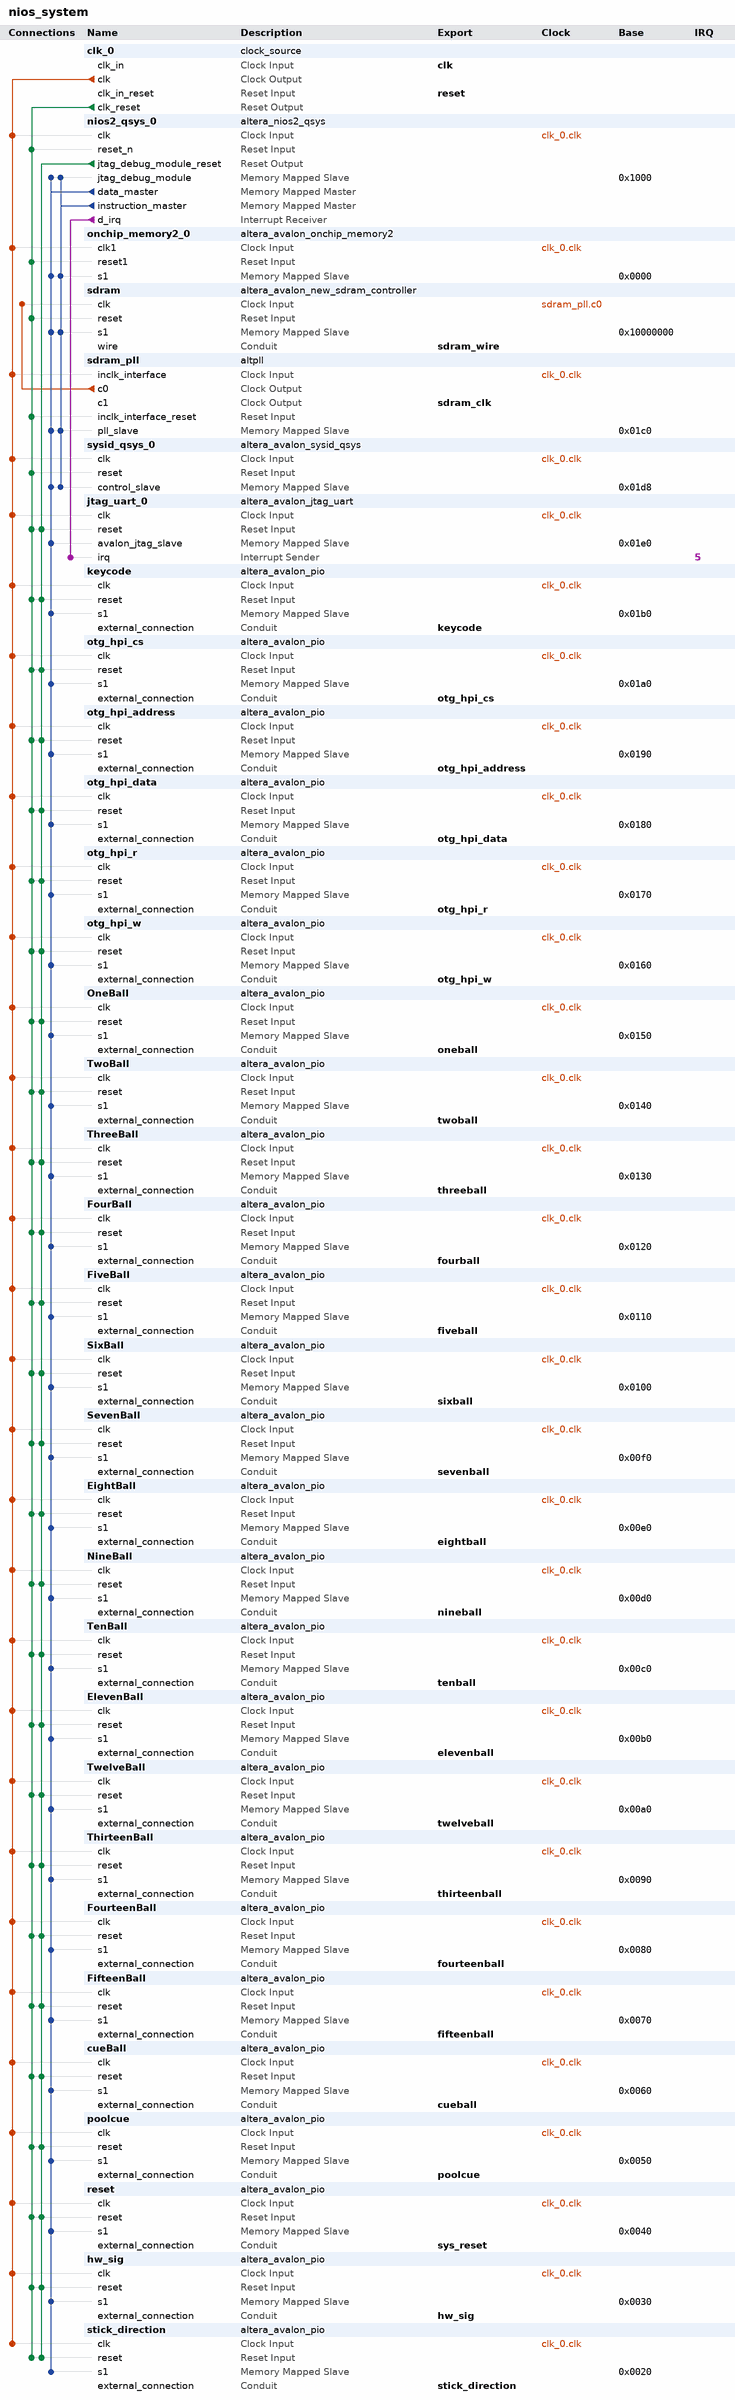
[diagram p0: system contents]
# Platform Designer (Qsys) system nios_system, Cyclone IV E EP4CE115F29C7
# Parameters at their usual value, and those the tool derives, are not listed.
package require -exact qsys 14.0
create_system nios_system
set_project_property DEVICE_FAMILY {Cyclone IV E}
set_project_property DEVICE EP4CE115F29C7

add_instance clk_0 clock_source 14.0
set_instance_parameter_value clk_0 clockFrequency 50000000

add_instance nios2_qsys_0 altera_nios2_qsys 14.0
set_instance_parameter_value nios2_qsys_0 resetrequest_enabled true
set_instance_parameter_value nios2_qsys_0 resetSlave sdram.s1
set_instance_parameter_value nios2_qsys_0 mmu_TLBMissExcSlave None
set_instance_parameter_value nios2_qsys_0 exceptionSlave sdram.s1
set_instance_parameter_value nios2_qsys_0 breakSlave nios2_qsys_0.jtag_debug_module
set_instance_parameter_value nios2_qsys_0 impl Tiny
set_instance_parameter_value nios2_qsys_0 icache_size 4096

add_instance onchip_memory2_0 altera_avalon_onchip_memory2 14.0
set_instance_parameter_value onchip_memory2_0 dataWidth 32
set_instance_parameter_value onchip_memory2_0 dualPort false
set_instance_parameter_value onchip_memory2_0 initMemContent true
set_instance_parameter_value onchip_memory2_0 initializationFileName onchip_mem.hex
set_instance_parameter_value onchip_memory2_0 memorySize 16

add_instance sdram altera_avalon_new_sdram_controller 14.0
set_instance_parameter_value sdram TAC 5.5
set_instance_parameter_value sdram TRCD 20.0
set_instance_parameter_value sdram TRP 20.0
set_instance_parameter_value sdram casLatency 3
set_instance_parameter_value sdram columnWidth 10
set_instance_parameter_value sdram dataWidth 32
set_instance_parameter_value sdram generateSimulationModel false
set_instance_parameter_value sdram model single_Micron_MT48LC4M32B2_7_chip
set_instance_parameter_value sdram numberOfBanks 4
set_instance_parameter_value sdram numberOfChipSelects 1
set_instance_parameter_value sdram powerUpDelay 200.0
set_instance_parameter_value sdram refreshPeriod 7.8125
set_instance_parameter_value sdram rowWidth 13

add_instance sdram_pll altpll 14.0
set_instance_parameter_value sdram_pll INCLK0_INPUT_FREQUENCY 20000
set_instance_parameter_value sdram_pll CLK0_MULTIPLY_BY 1
set_instance_parameter_value sdram_pll CLK1_MULTIPLY_BY 1
set_instance_parameter_value sdram_pll CLK0_DIVIDE_BY 1
set_instance_parameter_value sdram_pll CLK1_DIVIDE_BY 1
set_instance_parameter_value sdram_pll CLK1_PHASE_SHIFT -3000
set_instance_parameter_value sdram_pll CLK1_DUTY_CYCLE 50
set_instance_parameter_value sdram_pll PORT_clk1 PORT_USED
set_instance_parameter_value sdram_pll PORT_clk2 PORT_UNUSED
set_instance_parameter_value sdram_pll PORT_clk3 PORT_UNUSED
set_instance_parameter_value sdram_pll PORT_ARESET PORT_UNUSED
set_instance_parameter_value sdram_pll PORT_LOCKED PORT_UNUSED

add_instance sysid_qsys_0 altera_avalon_sysid_qsys 14.0
set_instance_parameter_value sysid_qsys_0 id 0

add_instance jtag_uart_0 altera_avalon_jtag_uart 14.0
set_instance_parameter_value jtag_uart_0 simInteractiveOptions NO_INTERACTIVE_WINDOWS

add_instance keycode altera_avalon_pio 14.0
set_instance_parameter_value keycode direction Output
set_instance_parameter_value keycode width 16

add_instance otg_hpi_cs altera_avalon_pio 14.0
set_instance_parameter_value otg_hpi_cs direction Output
set_instance_parameter_value otg_hpi_cs width 1

add_instance otg_hpi_address altera_avalon_pio 14.0
set_instance_parameter_value otg_hpi_address direction Output
set_instance_parameter_value otg_hpi_address width 2

add_instance otg_hpi_data altera_avalon_pio 14.0
set_instance_parameter_value otg_hpi_data direction InOut
set_instance_parameter_value otg_hpi_data width 16

add_instance otg_hpi_r altera_avalon_pio 14.0
set_instance_parameter_value otg_hpi_r direction Output
set_instance_parameter_value otg_hpi_r width 1

add_instance otg_hpi_w altera_avalon_pio 14.0
set_instance_parameter_value otg_hpi_w direction Output
set_instance_parameter_value otg_hpi_w width 1

add_instance OneBall altera_avalon_pio 14.0
set_instance_parameter_value OneBall direction Output
set_instance_parameter_value OneBall width 20

add_instance TwoBall altera_avalon_pio 14.0
set_instance_parameter_value TwoBall direction Output
set_instance_parameter_value TwoBall width 20

add_instance ThreeBall altera_avalon_pio 14.0
set_instance_parameter_value ThreeBall direction Output
set_instance_parameter_value ThreeBall width 20

add_instance FourBall altera_avalon_pio 14.0
set_instance_parameter_value FourBall direction Output
set_instance_parameter_value FourBall width 20

add_instance FiveBall altera_avalon_pio 14.0
set_instance_parameter_value FiveBall direction Output
set_instance_parameter_value FiveBall width 20

add_instance SixBall altera_avalon_pio 14.0
set_instance_parameter_value SixBall direction Output
set_instance_parameter_value SixBall width 20

add_instance SevenBall altera_avalon_pio 14.0
set_instance_parameter_value SevenBall direction Output
set_instance_parameter_value SevenBall width 20

add_instance EightBall altera_avalon_pio 14.0
set_instance_parameter_value EightBall direction Output
set_instance_parameter_value EightBall width 20

add_instance NineBall altera_avalon_pio 14.0
set_instance_parameter_value NineBall direction Output
set_instance_parameter_value NineBall width 20

add_instance TenBall altera_avalon_pio 14.0
set_instance_parameter_value TenBall direction Output
set_instance_parameter_value TenBall width 20

add_instance ElevenBall altera_avalon_pio 14.0
set_instance_parameter_value ElevenBall direction Output
set_instance_parameter_value ElevenBall width 20

add_instance TwelveBall altera_avalon_pio 14.0
set_instance_parameter_value TwelveBall direction Output
set_instance_parameter_value TwelveBall width 20

add_instance ThirteenBall altera_avalon_pio 14.0
set_instance_parameter_value ThirteenBall direction Output
set_instance_parameter_value ThirteenBall width 20

add_instance FourteenBall altera_avalon_pio 14.0
set_instance_parameter_value FourteenBall direction Output
set_instance_parameter_value FourteenBall width 20

add_instance FifteenBall altera_avalon_pio 14.0
set_instance_parameter_value FifteenBall direction Output
set_instance_parameter_value FifteenBall width 20

add_instance cueBall altera_avalon_pio 14.0
set_instance_parameter_value cueBall direction Output
set_instance_parameter_value cueBall width 20

add_instance poolcue altera_avalon_pio 14.0
set_instance_parameter_value poolcue direction Output
set_instance_parameter_value poolcue width 20

add_instance reset altera_avalon_pio 14.0
set_instance_parameter_value reset direction Input
set_instance_parameter_value reset width 1

add_instance hw_sig altera_avalon_pio 14.0
set_instance_parameter_value hw_sig direction Input
set_instance_parameter_value hw_sig width 1

add_instance stick_direction altera_avalon_pio 14.0
set_instance_parameter_value stick_direction direction Output
set_instance_parameter_value stick_direction width 3

# connections
add_connection clk_0.clk cueBall.clk clock
add_connection clk_0.clk EightBall.clk clock
add_connection clk_0.clk ElevenBall.clk clock
add_connection clk_0.clk FifteenBall.clk clock
add_connection clk_0.clk FiveBall.clk clock
add_connection clk_0.clk FourBall.clk clock
add_connection clk_0.clk FourteenBall.clk clock
add_connection clk_0.clk hw_sig.clk clock
add_connection clk_0.clk jtag_uart_0.clk clock
add_connection clk_0.clk keycode.clk clock
add_connection clk_0.clk NineBall.clk clock
add_connection clk_0.clk nios2_qsys_0.clk clock
add_connection clk_0.clk onchip_memory2_0.clk1 clock
add_connection clk_0.clk OneBall.clk clock
add_connection clk_0.clk otg_hpi_address.clk clock
add_connection clk_0.clk otg_hpi_cs.clk clock
add_connection clk_0.clk otg_hpi_data.clk clock
add_connection clk_0.clk otg_hpi_r.clk clock
add_connection clk_0.clk otg_hpi_w.clk clock
add_connection clk_0.clk poolcue.clk clock
add_connection clk_0.clk reset.clk clock
add_connection clk_0.clk sdram_pll.inclk_interface clock
add_connection clk_0.clk SevenBall.clk clock
add_connection clk_0.clk SixBall.clk clock
add_connection clk_0.clk stick_direction.clk clock
add_connection clk_0.clk sysid_qsys_0.clk clock
add_connection clk_0.clk TenBall.clk clock
add_connection clk_0.clk ThirteenBall.clk clock
add_connection clk_0.clk ThreeBall.clk clock
add_connection clk_0.clk TwelveBall.clk clock
add_connection clk_0.clk TwoBall.clk clock
add_connection sdram_pll.c0 sdram.clk clock
add_connection clk_0.clk_reset cueBall.reset reset
add_connection clk_0.clk_reset EightBall.reset reset
add_connection clk_0.clk_reset ElevenBall.reset reset
add_connection clk_0.clk_reset FifteenBall.reset reset
add_connection clk_0.clk_reset FiveBall.reset reset
add_connection clk_0.clk_reset FourBall.reset reset
add_connection clk_0.clk_reset FourteenBall.reset reset
add_connection clk_0.clk_reset hw_sig.reset reset
add_connection clk_0.clk_reset jtag_uart_0.reset reset
add_connection clk_0.clk_reset keycode.reset reset
add_connection clk_0.clk_reset NineBall.reset reset
add_connection clk_0.clk_reset nios2_qsys_0.reset_n reset
add_connection clk_0.clk_reset onchip_memory2_0.reset1 reset
add_connection clk_0.clk_reset OneBall.reset reset
add_connection clk_0.clk_reset otg_hpi_address.reset reset
add_connection clk_0.clk_reset otg_hpi_cs.reset reset
add_connection clk_0.clk_reset otg_hpi_data.reset reset
add_connection clk_0.clk_reset otg_hpi_r.reset reset
add_connection clk_0.clk_reset otg_hpi_w.reset reset
add_connection clk_0.clk_reset poolcue.reset reset
add_connection clk_0.clk_reset reset.reset reset
add_connection clk_0.clk_reset sdram.reset reset
add_connection clk_0.clk_reset sdram_pll.inclk_interface_reset reset
add_connection clk_0.clk_reset SevenBall.reset reset
add_connection clk_0.clk_reset SixBall.reset reset
add_connection clk_0.clk_reset stick_direction.reset reset
add_connection clk_0.clk_reset sysid_qsys_0.reset reset
add_connection clk_0.clk_reset TenBall.reset reset
add_connection clk_0.clk_reset ThirteenBall.reset reset
add_connection clk_0.clk_reset ThreeBall.reset reset
add_connection clk_0.clk_reset TwelveBall.reset reset
add_connection clk_0.clk_reset TwoBall.reset reset
add_connection nios2_qsys_0.jtag_debug_module_reset cueBall.reset reset
add_connection nios2_qsys_0.jtag_debug_module_reset EightBall.reset reset
add_connection nios2_qsys_0.jtag_debug_module_reset ElevenBall.reset reset
add_connection nios2_qsys_0.jtag_debug_module_reset FifteenBall.reset reset
add_connection nios2_qsys_0.jtag_debug_module_reset FiveBall.reset reset
add_connection nios2_qsys_0.jtag_debug_module_reset FourBall.reset reset
add_connection nios2_qsys_0.jtag_debug_module_reset FourteenBall.reset reset
add_connection nios2_qsys_0.jtag_debug_module_reset hw_sig.reset reset
add_connection nios2_qsys_0.jtag_debug_module_reset jtag_uart_0.reset reset
add_connection nios2_qsys_0.jtag_debug_module_reset keycode.reset reset
add_connection nios2_qsys_0.jtag_debug_module_reset NineBall.reset reset
add_connection nios2_qsys_0.jtag_debug_module_reset OneBall.reset reset
add_connection nios2_qsys_0.jtag_debug_module_reset otg_hpi_address.reset reset
add_connection nios2_qsys_0.jtag_debug_module_reset otg_hpi_cs.reset reset
add_connection nios2_qsys_0.jtag_debug_module_reset otg_hpi_data.reset reset
add_connection nios2_qsys_0.jtag_debug_module_reset otg_hpi_r.reset reset
add_connection nios2_qsys_0.jtag_debug_module_reset otg_hpi_w.reset reset
add_connection nios2_qsys_0.jtag_debug_module_reset poolcue.reset reset
add_connection nios2_qsys_0.jtag_debug_module_reset reset.reset reset
add_connection nios2_qsys_0.jtag_debug_module_reset SevenBall.reset reset
add_connection nios2_qsys_0.jtag_debug_module_reset SixBall.reset reset
add_connection nios2_qsys_0.jtag_debug_module_reset stick_direction.reset reset
add_connection nios2_qsys_0.jtag_debug_module_reset TenBall.reset reset
add_connection nios2_qsys_0.jtag_debug_module_reset ThirteenBall.reset reset
add_connection nios2_qsys_0.jtag_debug_module_reset ThreeBall.reset reset
add_connection nios2_qsys_0.jtag_debug_module_reset TwelveBall.reset reset
add_connection nios2_qsys_0.jtag_debug_module_reset TwoBall.reset reset
add_connection nios2_qsys_0.data_master cueBall.s1 avalon
set_connection_parameter_value nios2_qsys_0.data_master/cueBall.s1 baseAddress 0x0060
add_connection nios2_qsys_0.data_master EightBall.s1 avalon
set_connection_parameter_value nios2_qsys_0.data_master/EightBall.s1 baseAddress 0x00e0
add_connection nios2_qsys_0.data_master ElevenBall.s1 avalon
set_connection_parameter_value nios2_qsys_0.data_master/ElevenBall.s1 baseAddress 0x00b0
add_connection nios2_qsys_0.data_master FifteenBall.s1 avalon
set_connection_parameter_value nios2_qsys_0.data_master/FifteenBall.s1 baseAddress 0x0070
add_connection nios2_qsys_0.data_master FiveBall.s1 avalon
set_connection_parameter_value nios2_qsys_0.data_master/FiveBall.s1 baseAddress 0x0110
add_connection nios2_qsys_0.data_master FourBall.s1 avalon
set_connection_parameter_value nios2_qsys_0.data_master/FourBall.s1 baseAddress 0x0120
add_connection nios2_qsys_0.data_master FourteenBall.s1 avalon
set_connection_parameter_value nios2_qsys_0.data_master/FourteenBall.s1 baseAddress 0x0080
add_connection nios2_qsys_0.data_master hw_sig.s1 avalon
set_connection_parameter_value nios2_qsys_0.data_master/hw_sig.s1 baseAddress 0x0030
add_connection nios2_qsys_0.data_master jtag_uart_0.avalon_jtag_slave avalon
set_connection_parameter_value nios2_qsys_0.data_master/jtag_uart_0.avalon_jtag_slave baseAddress 0x01e0
add_connection nios2_qsys_0.data_master keycode.s1 avalon
set_connection_parameter_value nios2_qsys_0.data_master/keycode.s1 baseAddress 0x01b0
add_connection nios2_qsys_0.data_master NineBall.s1 avalon
set_connection_parameter_value nios2_qsys_0.data_master/NineBall.s1 baseAddress 0x00d0
add_connection nios2_qsys_0.data_master nios2_qsys_0.jtag_debug_module avalon
set_connection_parameter_value nios2_qsys_0.data_master/nios2_qsys_0.jtag_debug_module baseAddress 0x1000
add_connection nios2_qsys_0.data_master onchip_memory2_0.s1 avalon
set_connection_parameter_value nios2_qsys_0.data_master/onchip_memory2_0.s1 baseAddress 0x0000
add_connection nios2_qsys_0.data_master OneBall.s1 avalon
set_connection_parameter_value nios2_qsys_0.data_master/OneBall.s1 baseAddress 0x0150
add_connection nios2_qsys_0.data_master otg_hpi_address.s1 avalon
set_connection_parameter_value nios2_qsys_0.data_master/otg_hpi_address.s1 baseAddress 0x0190
add_connection nios2_qsys_0.data_master otg_hpi_cs.s1 avalon
set_connection_parameter_value nios2_qsys_0.data_master/otg_hpi_cs.s1 baseAddress 0x01a0
add_connection nios2_qsys_0.data_master otg_hpi_data.s1 avalon
set_connection_parameter_value nios2_qsys_0.data_master/otg_hpi_data.s1 baseAddress 0x0180
add_connection nios2_qsys_0.data_master otg_hpi_r.s1 avalon
set_connection_parameter_value nios2_qsys_0.data_master/otg_hpi_r.s1 baseAddress 0x0170
add_connection nios2_qsys_0.data_master otg_hpi_w.s1 avalon
set_connection_parameter_value nios2_qsys_0.data_master/otg_hpi_w.s1 baseAddress 0x0160
add_connection nios2_qsys_0.data_master poolcue.s1 avalon
set_connection_parameter_value nios2_qsys_0.data_master/poolcue.s1 baseAddress 0x0050
add_connection nios2_qsys_0.data_master reset.s1 avalon
set_connection_parameter_value nios2_qsys_0.data_master/reset.s1 baseAddress 0x0040
add_connection nios2_qsys_0.data_master sdram.s1 avalon
set_connection_parameter_value nios2_qsys_0.data_master/sdram.s1 baseAddress 0x10000000
add_connection nios2_qsys_0.data_master sdram_pll.pll_slave avalon
set_connection_parameter_value nios2_qsys_0.data_master/sdram_pll.pll_slave baseAddress 0x01c0
add_connection nios2_qsys_0.data_master SevenBall.s1 avalon
set_connection_parameter_value nios2_qsys_0.data_master/SevenBall.s1 baseAddress 0x00f0
add_connection nios2_qsys_0.data_master SixBall.s1 avalon
set_connection_parameter_value nios2_qsys_0.data_master/SixBall.s1 baseAddress 0x0100
add_connection nios2_qsys_0.data_master stick_direction.s1 avalon
set_connection_parameter_value nios2_qsys_0.data_master/stick_direction.s1 baseAddress 0x0020
add_connection nios2_qsys_0.data_master sysid_qsys_0.control_slave avalon
set_connection_parameter_value nios2_qsys_0.data_master/sysid_qsys_0.control_slave baseAddress 0x01d8
add_connection nios2_qsys_0.data_master TenBall.s1 avalon
set_connection_parameter_value nios2_qsys_0.data_master/TenBall.s1 baseAddress 0x00c0
add_connection nios2_qsys_0.data_master ThirteenBall.s1 avalon
set_connection_parameter_value nios2_qsys_0.data_master/ThirteenBall.s1 baseAddress 0x0090
add_connection nios2_qsys_0.data_master ThreeBall.s1 avalon
set_connection_parameter_value nios2_qsys_0.data_master/ThreeBall.s1 baseAddress 0x0130
add_connection nios2_qsys_0.data_master TwelveBall.s1 avalon
set_connection_parameter_value nios2_qsys_0.data_master/TwelveBall.s1 baseAddress 0x00a0
add_connection nios2_qsys_0.data_master TwoBall.s1 avalon
set_connection_parameter_value nios2_qsys_0.data_master/TwoBall.s1 baseAddress 0x0140
add_connection nios2_qsys_0.instruction_master nios2_qsys_0.jtag_debug_module avalon
set_connection_parameter_value nios2_qsys_0.instruction_master/nios2_qsys_0.jtag_debug_module baseAddress 0x1000
add_connection nios2_qsys_0.instruction_master onchip_memory2_0.s1 avalon
set_connection_parameter_value nios2_qsys_0.instruction_master/onchip_memory2_0.s1 baseAddress 0x0000
add_connection nios2_qsys_0.instruction_master sdram.s1 avalon
set_connection_parameter_value nios2_qsys_0.instruction_master/sdram.s1 baseAddress 0x10000000
add_connection nios2_qsys_0.instruction_master sdram_pll.pll_slave avalon
set_connection_parameter_value nios2_qsys_0.instruction_master/sdram_pll.pll_slave baseAddress 0x01c0
add_connection nios2_qsys_0.instruction_master sysid_qsys_0.control_slave avalon
set_connection_parameter_value nios2_qsys_0.instruction_master/sysid_qsys_0.control_slave baseAddress 0x01d8
add_connection nios2_qsys_0.d_irq jtag_uart_0.irq interrupt
set_connection_parameter_value nios2_qsys_0.d_irq/jtag_uart_0.irq irqNumber 5

# exported interfaces
add_interface clk clock sink
set_interface_property clk EXPORT_OF clk_0.clk_in
add_interface cueball conduit end
set_interface_property cueball EXPORT_OF cueBall.external_connection
add_interface eightball conduit end
set_interface_property eightball EXPORT_OF EightBall.external_connection
add_interface elevenball conduit end
set_interface_property elevenball EXPORT_OF ElevenBall.external_connection
add_interface fifteenball conduit end
set_interface_property fifteenball EXPORT_OF FifteenBall.external_connection
add_interface fiveball conduit end
set_interface_property fiveball EXPORT_OF FiveBall.external_connection
add_interface fourball conduit end
set_interface_property fourball EXPORT_OF FourBall.external_connection
add_interface fourteenball conduit end
set_interface_property fourteenball EXPORT_OF FourteenBall.external_connection
add_interface keycode conduit end
set_interface_property keycode EXPORT_OF keycode.external_connection
add_interface nineball conduit end
set_interface_property nineball EXPORT_OF NineBall.external_connection
add_interface oneball conduit end
set_interface_property oneball EXPORT_OF OneBall.external_connection
add_interface otg_hpi_address conduit end
set_interface_property otg_hpi_address EXPORT_OF otg_hpi_address.external_connection
add_interface otg_hpi_cs conduit end
set_interface_property otg_hpi_cs EXPORT_OF otg_hpi_cs.external_connection
add_interface otg_hpi_data conduit end
set_interface_property otg_hpi_data EXPORT_OF otg_hpi_data.external_connection
add_interface otg_hpi_r conduit end
set_interface_property otg_hpi_r EXPORT_OF otg_hpi_r.external_connection
add_interface otg_hpi_w conduit end
set_interface_property otg_hpi_w EXPORT_OF otg_hpi_w.external_connection
add_interface poolcue conduit end
set_interface_property poolcue EXPORT_OF poolcue.external_connection
add_interface reset reset sink
set_interface_property reset EXPORT_OF clk_0.clk_in_reset
add_interface sdram_clk clock source
set_interface_property sdram_clk EXPORT_OF sdram_pll.c1
add_interface sdram_wire conduit end
set_interface_property sdram_wire EXPORT_OF sdram.wire
add_interface sevenball conduit end
set_interface_property sevenball EXPORT_OF SevenBall.external_connection
add_interface sixball conduit end
set_interface_property sixball EXPORT_OF SixBall.external_connection
add_interface tenball conduit end
set_interface_property tenball EXPORT_OF TenBall.external_connection
add_interface thirteenball conduit end
set_interface_property thirteenball EXPORT_OF ThirteenBall.external_connection
add_interface threeball conduit end
set_interface_property threeball EXPORT_OF ThreeBall.external_connection
add_interface twelveball conduit end
set_interface_property twelveball EXPORT_OF TwelveBall.external_connection
add_interface twoball conduit end
set_interface_property twoball EXPORT_OF TwoBall.external_connection
add_interface sys_reset conduit end
set_interface_property sys_reset EXPORT_OF reset.external_connection
add_interface hw_sig conduit end
set_interface_property hw_sig EXPORT_OF hw_sig.external_connection
add_interface stick_direction conduit end
set_interface_property stick_direction EXPORT_OF stick_direction.external_connection

set_interconnect_requirement {$system} qsys_mm.clockCrossingAdapter HANDSHAKE
set_interconnect_requirement {$system} qsys_mm.maxAdditionalLatency 1
set_interconnect_requirement {$system} qsys_mm.insertDefaultSlave FALSE

save_system nios_system.qsys
